# EAGLE design DimmerV1.2 (EAGLE 7.6.0)
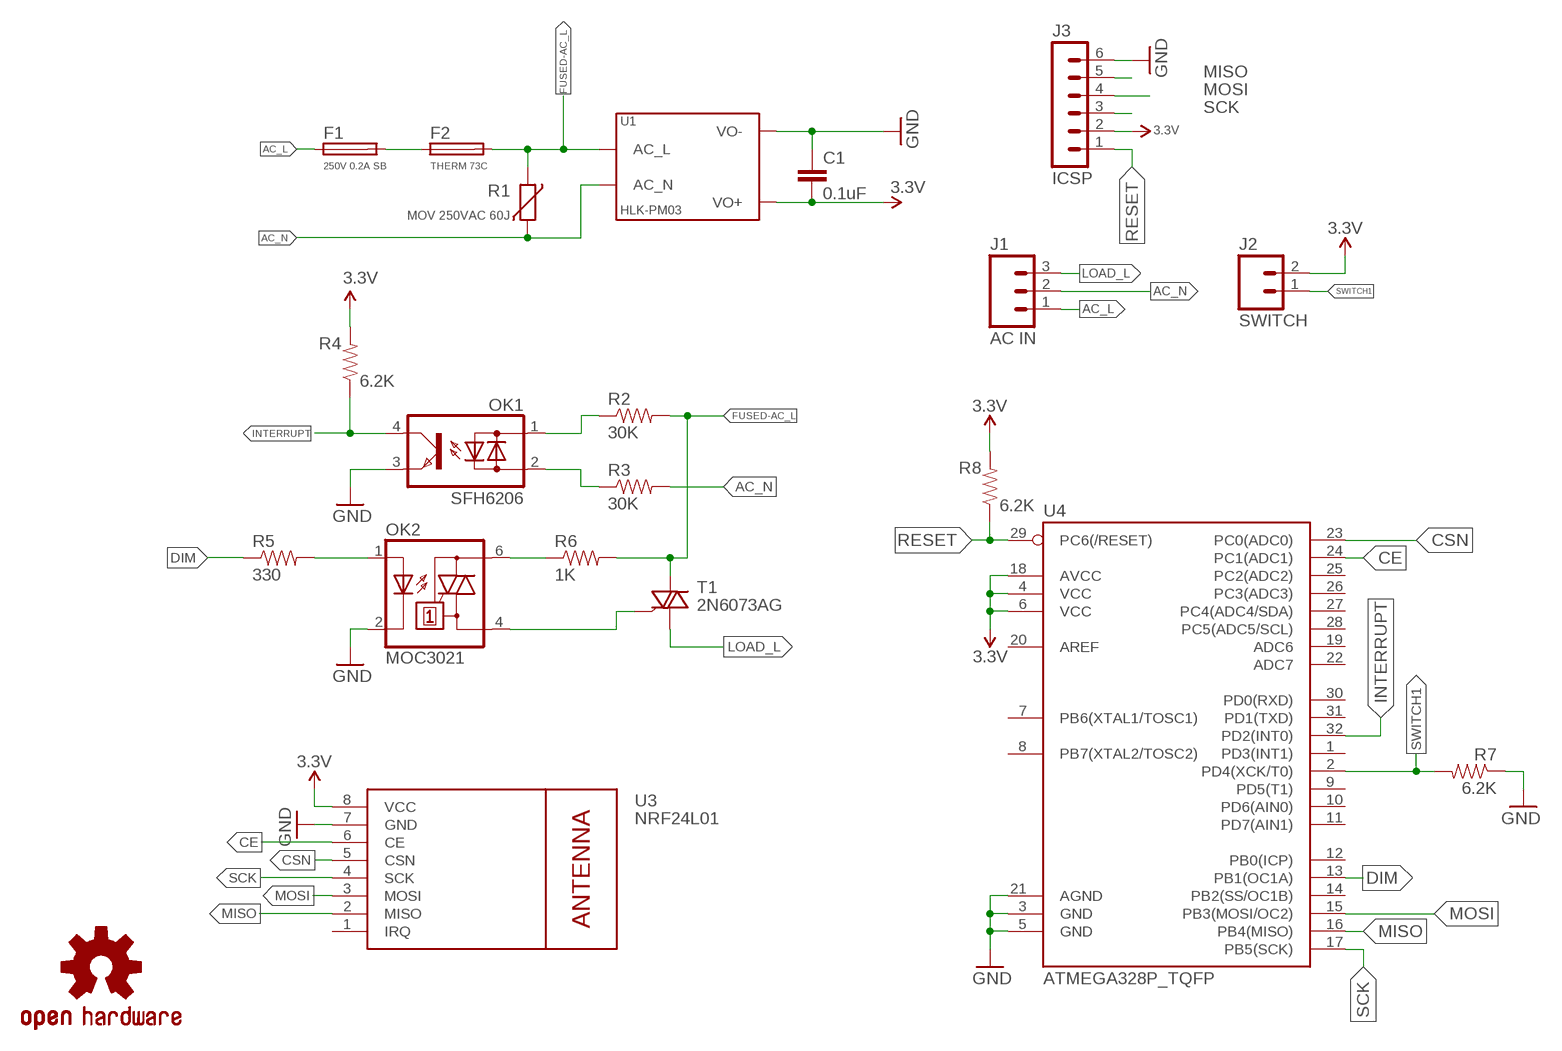
[diagram p0: schematic, sheet 1]

## Parts
C1  0.1uF  CAP0805  [0805]
F1  250V 0.2A SB  TR5  [TR5]
F2  THERM 73C  TE5  [TE5]
J1  AC IN  M03-SCREW-5MM  [SCREWTERMINAL-5MM-3]
J2  SWITCH  M025MM  [SCREWTERMINAL-5MM-2]
J3  ICSP  HEADER-06X1-MALE  [06X1-PTH]
LOGO1  OSHW-LOGOM  [OSHW-LOGO-M]
OK1  SFH6206  [DIL4-SMD]
OK2  MOC3021  MOC3043S  [DIL6-SMD]
R1  MOV 250VAC 60J  VARISTORS05K11  [S05K11]
R2  30K  RESISTOR0805-RES  [0805]
R3  30K  RESISTOR0805-RES  [0805]
R4  6.2K  RESISTOR0805-RES  [0805]
R5  330  RESISTOR0805-RES  [0805]
R6  1K  RESISTOR0805-RES  [0805]
R7  6.2K  RESISTOR0805-RES  [0805]
R8  6.2K  RESISTOR0805-RES  [0805]
T1  2N6073AG  TIC225S  [TO220DS]
U1  HLK-PM03  [HLK-PM03]
U3  NRF24L01  WIRELESS-NRF24L01SMD  [WIRELESS-NRF24L01-SMD]
U4  ATMEGA328P_TQFP  [TQFP32-08]

## Nets
3.3V: C1.2 J2.2 J3.2 R4.2 R8.2 U1.VO+ U3.8(VCC) U4.4(VCC) U4.6(VCC) U4.18(AVCC)
AC_L: F1.1 J1.1
AC_N: J1.2 R1.2 R3.2 U1.AC_N
CE: U3.6(CE) U4.24(PC1(ADC1))
CSN: U3.5(CSN) U4.23(PC0(ADC0))
DIM: R5.1 U4.13(PB1(OC1A))
FUSED-AC_L: F2.2 R1.1 R2.2 R6.2 T1.A2 U1.AC_L
GND: C1.1 J3.6 OK1.3(E) OK2.2(C) R7.1 U1.VO- U3.7(GND) U4.3(GND) U4.5(GND) U4.21(AGND)
INTERRUPT: OK1.4(C) R4.1 U4.32(PD2(INT0))
LOAD_L: J1.3 T1.A1
MISO: J3.5 U3.2(MISO) U4.16(PB4(MISO))
MOSI: J3.4 U3.3(MOSI) U4.15(PB3(MOSI/OC2))
N$1: F1.2 F2.1
N$3: OK1.1(AC1) R2.1
N$4: OK1.2(AC2) R3.1
N$5: OK2.1(A) R5.2
N$6: OK2.4(A1) T1.G
N$7: OK2.6(A2) R6.1
RESET: J3.1 R8.1 U4.29(PC6(/RESET))
SCK: J3.3 U3.4(SCK) U4.17(PB5(SCK))
SWITCH1: J2.1 R7.2 U4.2(PD4(XCK/T0))
Unconnected: U3.1(IRQ) U4.1(PD3(INT1)) U4.7(PB6(XTAL1/TOSC1)) U4.8(PB7(XTAL2/TOSC2)) U4.9(PD5(T1)) U4.10(PD6(AIN0)) U4.11(PD7(AIN1)) U4.12(PB0(ICP)) U4.14(PB2(SS/OC1B)) U4.19(ADC6) U4.20(AREF) U4.22(ADC7) U4.25(PC2(ADC2)) U4.26(PC3(ADC3)) U4.27(PC4(ADC4/SDA)) U4.28(PC5(ADC5/SCL)) U4.30(PD0(RXD)) U4.31(PD1(TXD))

## Library data of the parts
C1 = SparkFun-Capacitors:CAP: Capacitor Standard 0603 ceramic capacitor, and 0.1" leaded capacitor.
F1 = fuse:TR5: FUSE Wickmann; OC_FARNELL: unknown; OC_NEWARK: unknown
F2 = fuse:TE5: FUSE Wickmann; OC_FARNELL: unknown; OC_NEWARK: unknown
J1 = SparkFun-Connectors:M03: Header 3 Standard 3-pin 0.1" header. Use with straight break away headers (SKU : PRT-00116), right angle break away headers (PRT-00553), swiss pins (PRT-00743), machine pins (PRT-00117), and female headers (PRT-00115). Molex polarized connector foot print use with SKU : PRT-08232 with associated crimp pins and housings.; STOREFRONT_ID: PRT-08433
J2 = SparkFun-Connectors:M02: Standard 2-pin 0.1" header. Use with - straight break away headers ( PRT-00116) - right angle break away headers (PRT-00553) - swiss pins (PRT-00743) - machine pins (PRT-00117) - female headers (PRT-00115) Molex polarized connector foot print use with: PRT-08233 with associated crimp pins and housings. 2.54_SCREWTERM for use with PRT-10571. 3.5mm Screw Terminal footprints for PRT-08084 5mm Screw Terminal footprints for use with PRT-08432; STOREFRONT_ID: PRT-08432
J3 = GeekAmmo:HEADER-06X1?: 6 x 0.1 inch Header 40x1 0.1inch Male Breakaway header can be used. - 4UCON 00834 <http://www.4uconnector.com/online/SearchPro.asp?FormName=ProSearch&FormAction=search&s_GroupNo=&s_keyword=00834> For female part, if possible use 6 x 1 without breaking.; OTHER: 4UCON 00834; URL: http://www.4uconnector.com/online/SearchPro.asp?FormName=ProSearch&FormAction=search&s_GroupNo=&s_keyword=00834
LOGO1 = SparkFun-Aesthetics:OSHW-LOGO: Open Source Hardware Logo This logo indicates the piece of hardware it is found on incorporates a OSHW license and/or adheres to the definition of open source hardware found here: http://freedomdefined.org/OSHW
OK1 = optocoupler:SFH620: Optocoupler, Phototransistor Output, AC Input Source: http://www.vishay.com/docs/83675/sfh620.pdf; MF: VISHAY/TELEFUNKEN; MPN: SFH6206-3; OC_FARNELL: 1469585; OC_NEWARK: 58K2214
OK2 = optocoupler:MOC30*: 6-Pin DIP Zero-Cross Optoisolators Triac Driver Output (250/400 Volt Peak) Source: Data sheet <http://www.fairchildsemi.com/ds/MO/MOC3031M.pdf> The old path of data sheet not more available 2013-05-06.; MF: FAIRCHILD SEMICONDUCTOR; MPN: MOC3043SM; OC_FARNELL: 1505441; OC_NEWARK: 78K6091
R1 = varistor:VARISTOR: VARISTOR
R2 R3 R5 R6 = SparkFun-Resistors:RESISTOR: Resistor Basic schematic elements and footprints for 0603, 1206, and PTH resistors.
R4 R7 R8 = SparkFun-Passives:RESISTOR: Resistor Basic schematic elements and footprints for 0603, 1206, and PTH resistors.
T1 = triac:TIC225S: TRIAC
U1 = CustomParts:HLK-PM03
U3 = nrf24l01plus:WIRELESS-NRF24L01: 2.4 GHz Wireless Module based on NRF24L01 chip
U4 = SparkFun-DigitalIC:ATMEGA328P_TQFP; PROD_ID: IC-09069

## Board
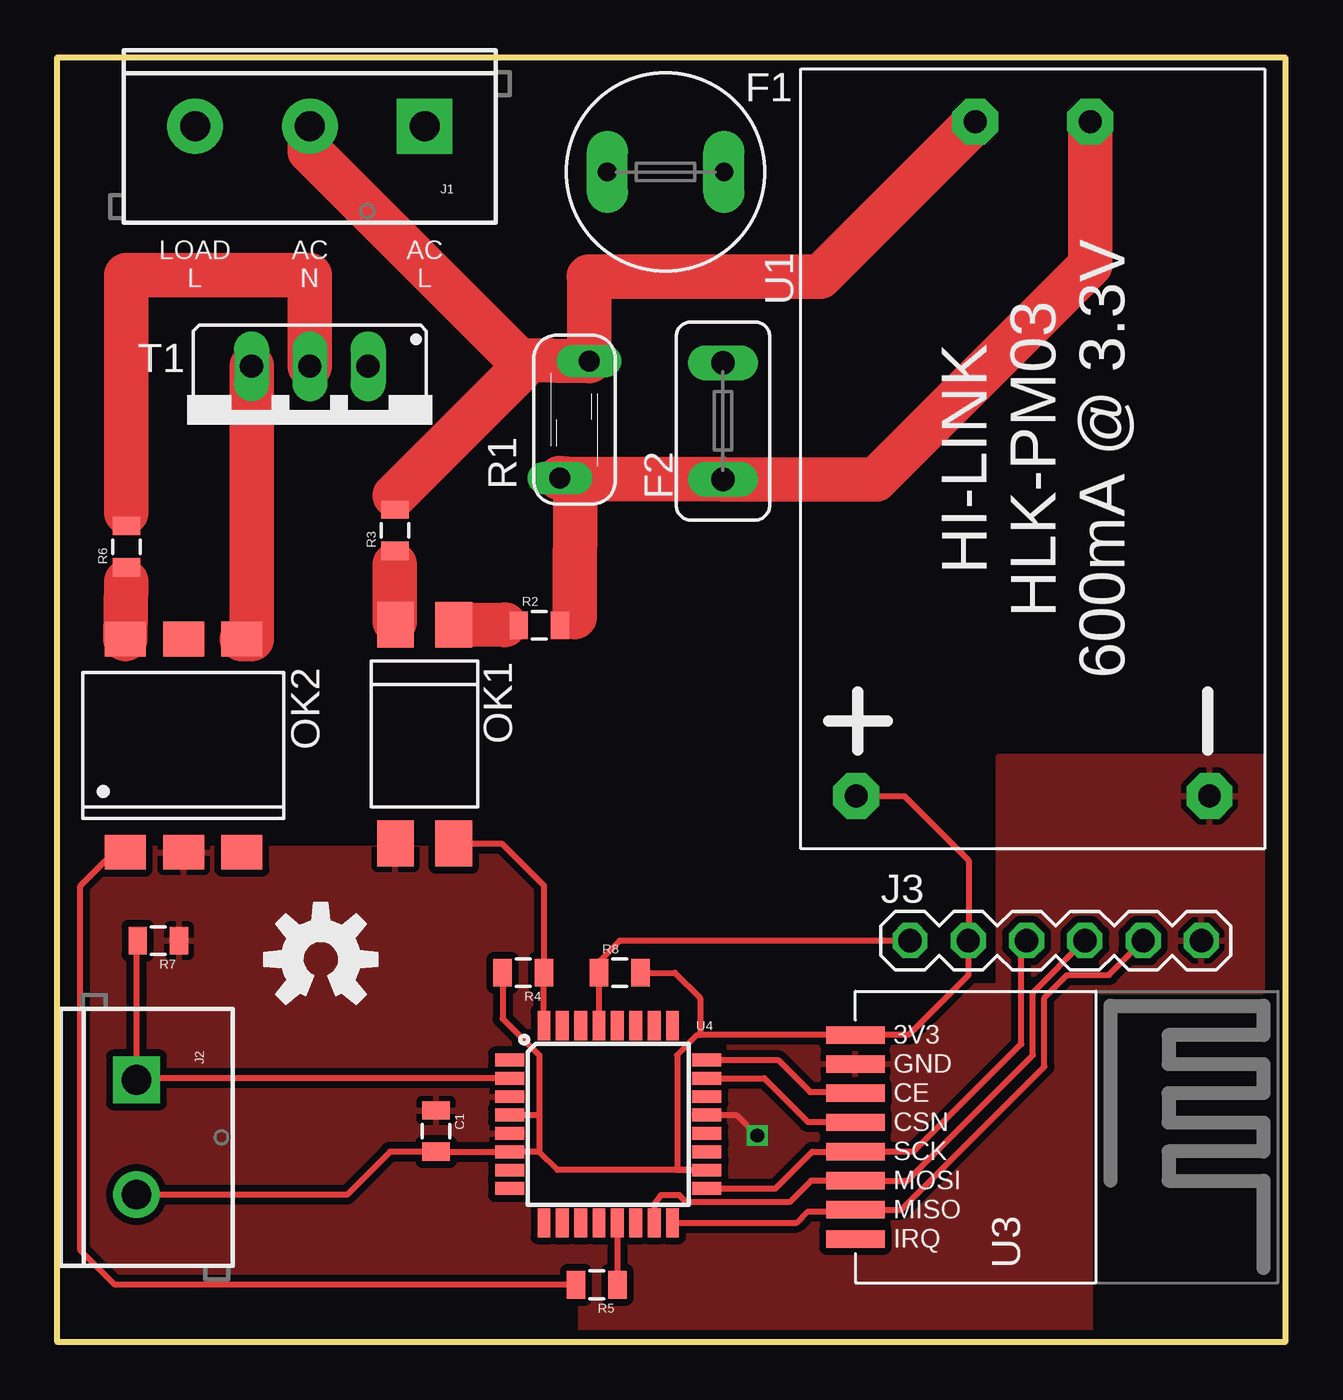
[diagram p1: board, top side]
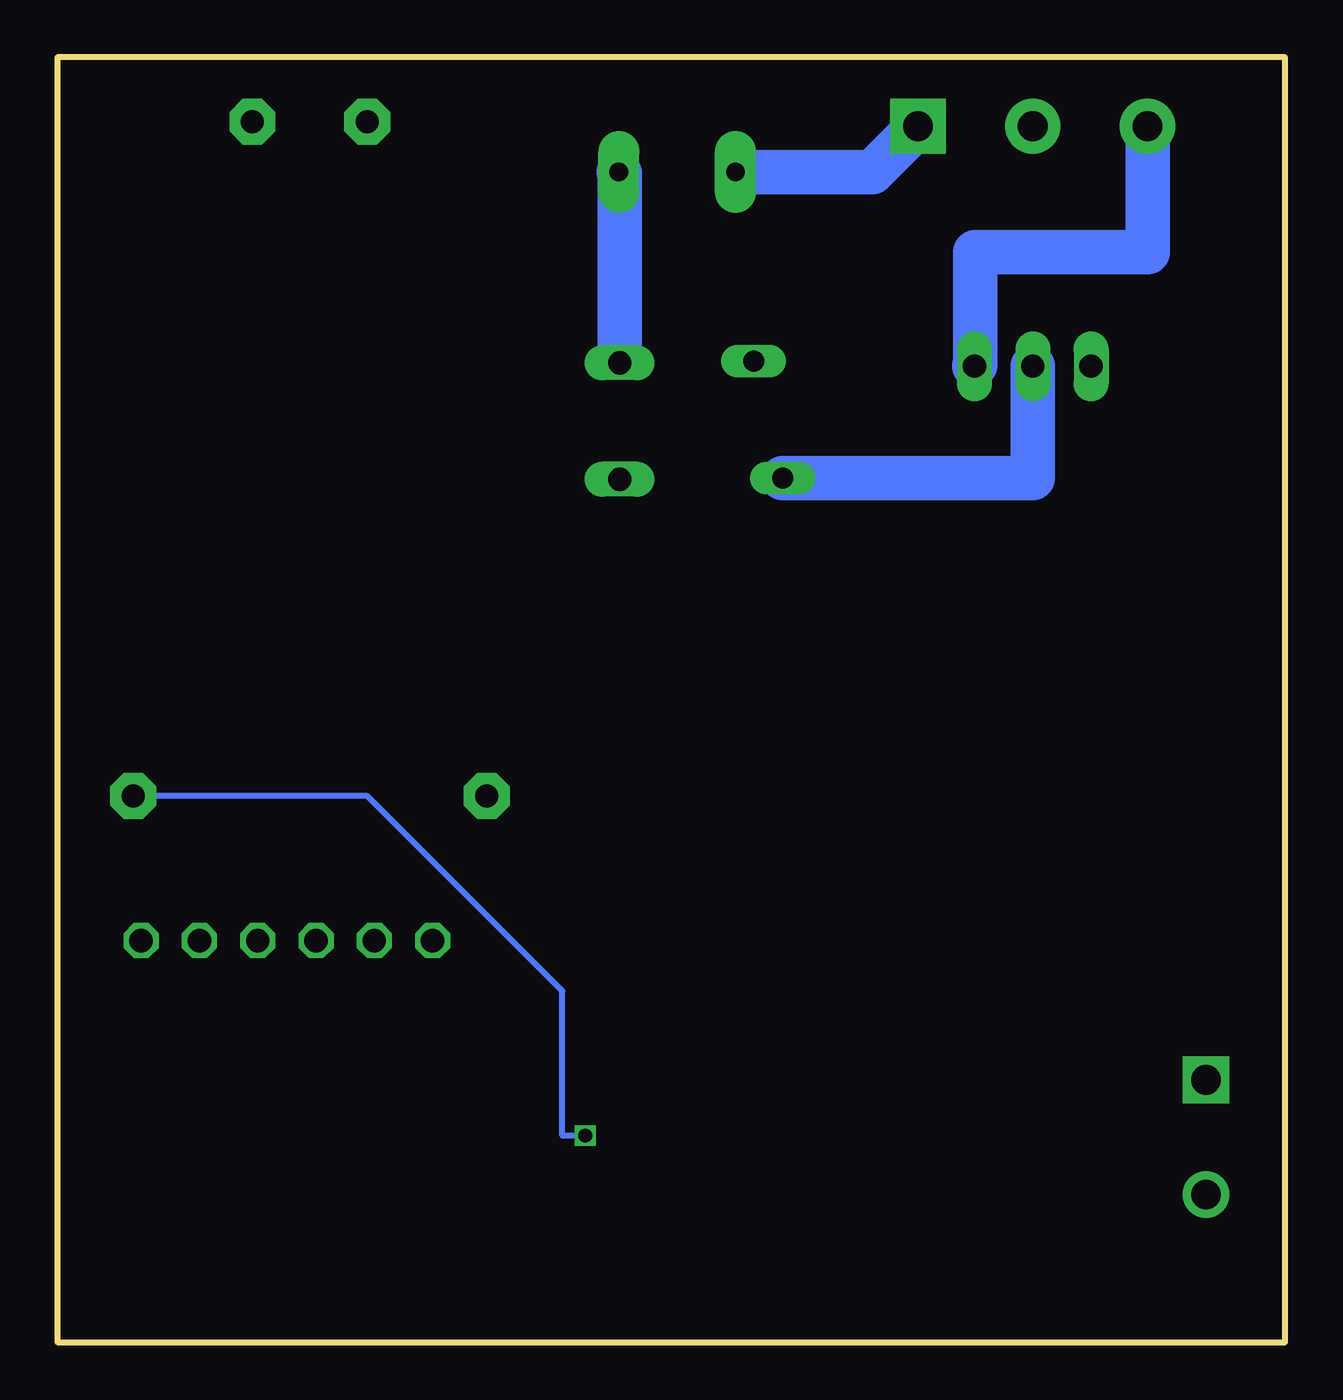
[diagram p2: board, bottom side, seen from below]

Size 53.5 x 56 mm. Coordinates in mm from the lower left corner, seen from the top.
Outline: 53.5,0 0,0 0,56 53.5,56 53.5,0
Copper layers (1*16): Top 0.035mm / dielectric 1.5mm / Bottom 0.035mm
Design rules "NOA Eagle Rule 2016-06-12": minimum track width 6mil, minimum drill 0.3mm, track to track 6mil, track to pad 6mil, pad to pad 6mil, via to via 6mil, smd to smd 0mil, copper to edge 0.4mm, drill to drill 10mil, minimum pad ring 10mil, minimum via ring 6mil, stop-mask expansion 2mil, vias tented up to drill 25mil, thermal gap 10mil

### Footprints (pad centres in the part's own frame; a part is rotated, then mirrored left to right if it is on the bottom)
0805 = smd 0.8 x 1.2: 1 -0.9,0; 2 0.9,0
TR5 = drill 0.813 pad 1.778 long: 1 -2.54,0; 2 2.54,0
TE5 = drill 1.016 long: 1 -2.54,0; 2 2.54,0
SCREWTERMINAL-5MM-3 = drill 1.3 pad 2.413 square: 1 0,0 | drill 1.3 pad 2.413: 2 5,0; 3 10,0
SCREWTERMINAL-5MM-2 = drill 1.3 pad 2.032 square: 1 0,0 | drill 1.3 pad 2.032: 2 5,0
06X1-PTH = drill 1.016 octagon: 1 -6.35,0; 2 -3.81,0; 3 -1.27,0; 4 1.27,0; 5 3.81,0; 6 6.35,0
DIL4-SMD = smd 1.6 x 2: 1 -1.27,-4.77; 2 1.27,-4.77; 3 1.27,4.77; 4 -1.27,4.77
DIL6-SMD = smd 1.78 x 1.52: 1 -2.54,-4.645; 2 0,-4.645; 3 2.54,-4.645; 4 2.54,4.645; 5 0,4.645; 6 -2.54,4.645
S05K11 = drill 0.914 long: 1 -0.635,-2.54; 2 0.635,2.54
TO220DS = drill 1.016 long: A1 -2.54,-2.54; A2 0,-2.54; G 2.54,-2.54
HLK-PM03 = drill 1 pad 2 octagon: AC_L -14.7,2.5; AC_N -14.7,-2.5; VO+ 14.7,-7.7; VO- 14.7,7.7
WIRELESS-NRF24L01-SMD = smd 2.54 x 0.762: 1 1.27,0; 2 1.27,1.27; 3 1.27,2.54; 4 1.27,3.81; 5 1.27,5.08; 6 1.27,6.35; 7 1.27,7.62; 8 1.27,8.89
TQFP32-08 = smd 1.27 x 0.559: 1 -4.293,2.8; 2 -4.293,2; 3 -4.293,1.2; 4 -4.293,0.4; 5 -4.293,-0.4; 6 -4.293,-1.2; 7 -4.293,-2; 8 -4.293,-2.8; 17 4.293,-2.8; 18 4.293,-2; 19 4.293,-1.2; 20 4.293,-0.4; 21 4.293,0.4; 22 4.293,1.2; 23 4.293,2; 24 4.293,2.8 | smd 0.559 x 1.27: 9 -2.8,-4.293; 10 -2,-4.293; 11 -1.2,-4.293; 12 -0.4,-4.293; 13 0.4,-4.293; 14 1.2,-4.293; 15 2,-4.293; 16 2.8,-4.293; 25 2.8,4.293; 26 2,4.293; 27 1.2,4.293; 28 0.4,4.293; 29 -0.4,4.293; 30 -1.2,4.293; 31 -2,4.293; 32 -2.8,4.293

### Placement (x,y rotation side)
C1  16.5,9.2 270 top
F1  26.5,51 0 top
F2  29,40.15 270 top
J1  16,53 180 top
J2  3.45,11.43 270 top
J3  43.5,17.5 0 top
LOGO1  11.48,16.69 0 top
OK1  16,26.5 180 top
OK2  5.5,26 0 top
R1  22.53,40.21 0 top
R2  21,31.25 0 top
R3  14.71,35.39 90 top
R4  20.3,16.1 180 top
R5  23.5,2.5 180 top
R6  3.01,34.67 90 top
R7  4.4,17.5 180 top
R8  24.5,16.1 0 top
T1  11,40 180 top
U1  42.5,38.5 270 top
U3  33.5,4.5 0 top
U4  24,9.5 0 top

### Tracks (layer width: path | path; a pad name or v marks a point on that pad's centre or on a via)
3.3V
  Top 0.254: 28,13.39 U3.8 37.1,13.4 39.69,15.99 J3.2 39.7,21 36.9,23.8 U1.VO+ | 28,13.39 27.89,13.39 27,12.5 27,7.5 U4.18 21.8,7.5 21,8.3 | 21,8.3 U4.6 C1.2 14.5,8.3 12.63,6.43 J2.2 | U4.4 21,9.9 | 21,9.9 21,8.3 | R4.2 19.4,14.1 21,12.5 21,9.9 | R8.2 26.9,16.1 28,15 28,13.39
AC_L
  Bottom 0.406: 23.5,51 F1.1
  Bottom 1.93: J1.1 18,51 23.5,51
AC_N
  Top 0.61: 14.7,36.9 R3.2
  Top 1.93: J1.2 11,51.9 20.1,42.8 | 20.1,42.8 R1.2 23.16,46.44 23.15,46.45 33.25,46.45 U1.AC_N | 20.1,42.8 20.1,42.3 14.7,36.9
CE
  Top 0.254: U4.24 31.4,12.3 32.8,10.9 34.72,10.9 U3.6
CSN
  Top 0.254: U4.23 30.8,11.5 32.7,9.6 34.75,9.6 U3.5
DIM
  Top 0.254: U4.13 R5.1
FUSED-AC_L
  Top 0.61: 3,36.15 R6.2 | R2.2 22.55,31.6
  Top 1.93: T1.A2 11,46.5 3,46.5 3,36.15 | R1.1 22.55,37.62 | 22.55,31.6 22.55,37.62 | 22.55,37.62 F2.2 35.65,37.6 45,46.95 U1.AC_L
  Bottom 1.93: T1.A2 11,37.67 R1.1
GND  (via drill 0.6)
  Top 0.254: U4.21 29.6,9.9 v30.5,9
  Bottom 0.254: v30.5,9 31.5,9 31.5,15.3 40,23.8 U1.VO-
  pour Top (isolate 0.305): 22.8,-2 45,-2 45,15.3 52.5,15.3 52.5,25.5 41,25.5 41,15.5 21.5,15.5 21.5,21.5 1,21.5 1,2 22.8,2
INTERRUPT
  Top 0.254: U4.32 R4.1 21.2,19.9 19.37,21.73 OK1.4
LOAD_L
  Bottom 1.93: J1.3 6,47.5 13.5,47.5 13.5,42.58 T1.A1
MISO
  Top 0.254: U4.16 32.21,5.21 32.7,5.7 34.7,5.7 U3.2 36.77,5.77 43,12 43,15 44,16 45.81,16 J3.5
MOSI
  Top 0.254: U4.15 26,6 26.3,6.4 27.1,6.4 27.4,6.1 31.9,6.1 32.84,7.04 U3.3 36.96,7.04 37,7 42.5,12.5 42.5,15.23 J3.4
N$1
  Bottom 0.61: 29,43 F2.1
  Bottom 1.93: F1.2 29,50.96 29,43
N$3
  Top 0.61: 19.5,31.25 R2.1
  Top 0.813: OK1.1 17.45,31.25
  Top 1.93: 17.45,31.25 19.5,31.27 19.5,31.25
N$4
  Top 0.61: OK1.2 14.7,31.4 | 14.7,33.9 R3.1
  Top 1.93: 14.7,31.4 14.7,33.9
N$5
  Top 0.254: R5.2 2.5,2.5 1,4 1,19.89 2.46,21.36 OK2.1
N$6
  Top 1.93: OK2.4 8.46,30.64 T1.G
N$7
  Top 0.813: R6.1 3,33.15
  Top 1.93: OK2.6 3,33.15
RESET
  Top 0.254: U4.29 R8.1 23.6,16.6 24.5,17.5 J3.1
SCK
  Top 0.254: U4.17 31.3,6.7 32.9,8.3 U3.4 37.31,8.31 42,13 42,16.77 J3.3
SWITCH1
  Top 0.254: R7.2 3.45,17.45 J2.1 3.52,11.5 U4.2

### Text on the board
tNames: LOAD / L | AC / N | AC / L